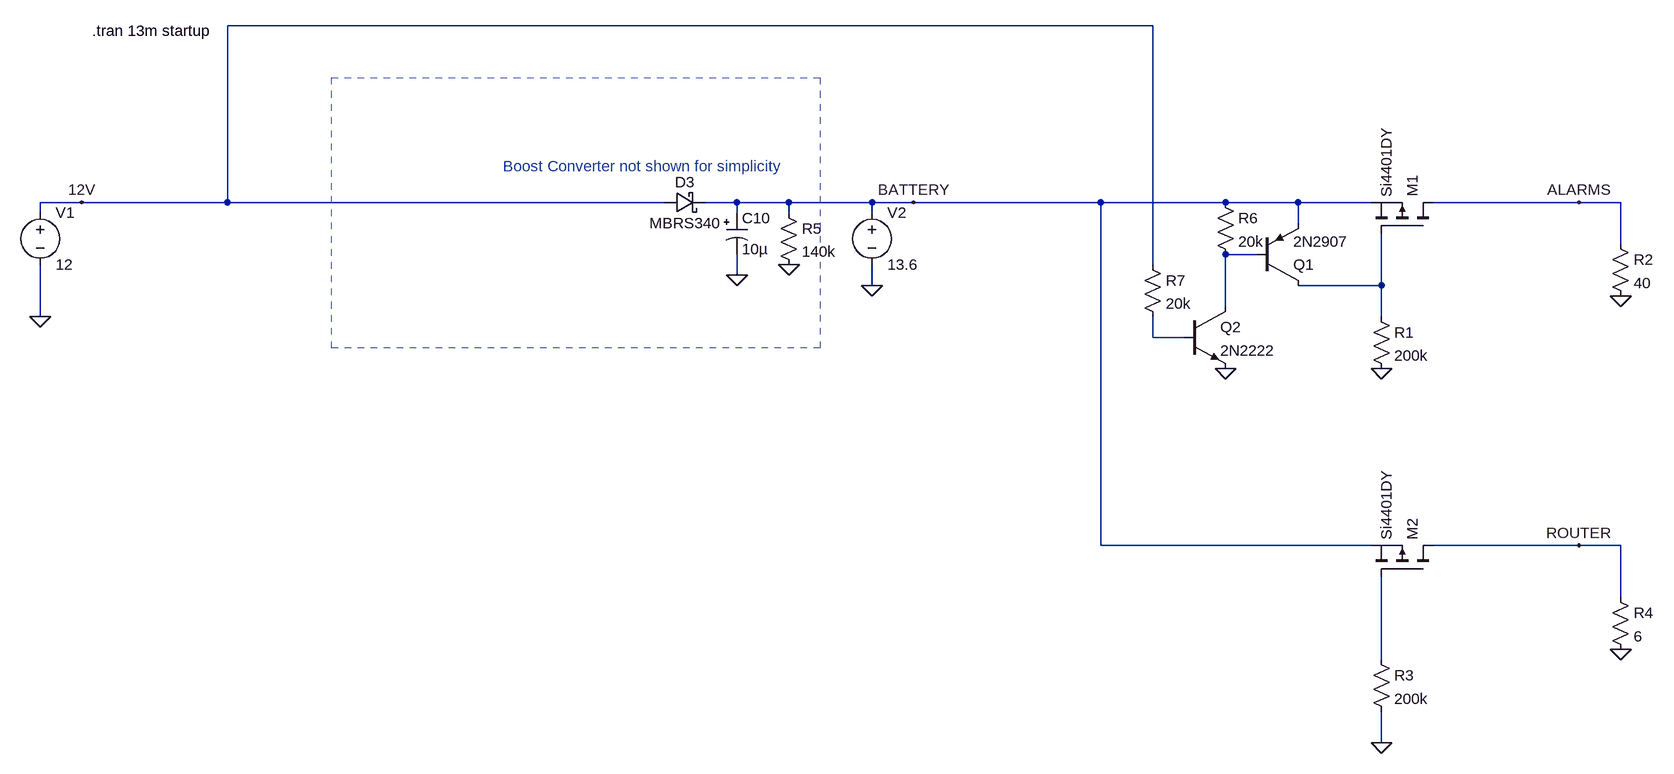
[diagram p0: schematic Security_Panel.asc]
Security_Panel.asc, the LTspice schematic file:
Version 4
SHEET 1 3064 1428
WIRE 2272 304 848 304
WIRE 624 576 560 576
WIRE 848 576 848 304
WIRE 848 576 624 576
WIRE 1520 576 848 576
WIRE 1632 576 1584 576
WIRE 1712 576 1632 576
WIRE 1840 576 1712 576
WIRE 1904 576 1840 576
WIRE 2192 576 1904 576
WIRE 2384 576 2192 576
WIRE 2496 576 2384 576
WIRE 2608 576 2496 576
WIRE 2928 576 2704 576
WIRE 2992 576 2928 576
WIRE 560 592 560 576
WIRE 1632 592 1632 576
WIRE 1712 592 1712 576
WIRE 1840 592 1840 576
WIRE 2496 608 2496 576
WIRE 2992 640 2992 576
WIRE 2432 656 2384 656
WIRE 2272 672 2272 304
WIRE 1632 688 1632 656
WIRE 1840 704 1840 672
WIRE 2624 704 2624 624
WIRE 2624 704 2496 704
WIRE 2384 736 2384 656
WIRE 560 752 560 672
WIRE 2624 752 2624 704
WIRE 2272 784 2272 752
WIRE 2320 784 2272 784
WIRE 2192 1104 2192 576
WIRE 2608 1104 2192 1104
WIRE 2928 1104 2704 1104
WIRE 2992 1104 2928 1104
WIRE 2992 1184 2992 1104
WIRE 2624 1280 2624 1152
WIRE 2624 1408 2624 1360
FLAG 1632 688 0
FLAG 1840 704 0
FLAG 560 752 0
FLAG 1904 576 BATTERY
FLAG 624 576 12V
FLAG 2992 720 0
FLAG 2992 1264 0
FLAG 2928 1104 ROUTER
FLAG 2928 576 ALARMS
FLAG 1712 672 0
FLAG 2624 832 0
FLAG 2384 832 0
FLAG 2624 1408 0
SYMBOL voltage 560 576 R0
SYMATTR InstName V1
SYMATTR Value 12
SYMBOL voltage 1840 576 R0
WINDOW 123 0 0 Left 0
WINDOW 39 0 0 Left 0
SYMATTR InstName V2
SYMATTR Value 13.6
SYMBOL schottky 1520 560 M90
WINDOW 0 0 32 VBottom 2
WINDOW 3 32 32 VTop 2
SYMATTR InstName D3
SYMATTR Value MBRS340
SYMBOL polcap 1616 592 R0
SYMATTR InstName C10
SYMATTR Value 10µ
SYMATTR SpiceLine Rser=.1
SYMBOL pmos 2704 624 M270
SYMATTR InstName M1
SYMATTR Value Si4401DY
SYMBOL res 2608 736 R0
SYMATTR InstName R1
SYMATTR Value 200k
SYMBOL res 2976 624 R0
SYMATTR InstName R2
SYMATTR Value 40
SYMBOL pmos 2704 1152 M270
SYMATTR InstName M2
SYMATTR Value Si4401DY
SYMBOL res 2608 1264 R0
SYMATTR InstName R3
SYMATTR Value 200k
SYMBOL res 2976 1168 R0
SYMATTR InstName R4
SYMATTR Value 6
SYMBOL res 1696 576 R0
SYMATTR InstName R5
SYMATTR Value 140k
SYMBOL pnp 2432 704 M180
SYMATTR InstName Q1
SYMATTR Value 2N2907
SYMBOL npn 2320 736 R0
SYMATTR InstName Q2
SYMATTR Value 2N2222
SYMBOL res 2368 560 R0
SYMATTR InstName R6
SYMATTR Value 20k
SYMBOL res 2256 656 R0
SYMATTR InstName R7
SYMATTR Value 20k
TEXT 640 312 Left 2 !.tran 13m startup
TEXT 1272 520 Left 2 ;Boost Converter not shown for simplicity
RECTANGLE Normal 1760 800 1008 384 2

The netlist it stands for:
* Security_Panel.asc
V1 12V 0 12
V2 BATTERY 0 13.6
D3 12V BATTERY MBRS340
C10 BATTERY 0 10µ Rser=.1
M1 ALARMS N002 BATTERY BATTERY Si4401DY
R1 N002 0 200k
R2 ALARMS 0 40
M2 ROUTER N004 BATTERY BATTERY Si4401DY
R3 N004 0 200k
R4 ROUTER 0 6
R5 BATTERY 0 140k
Q1 N002 N001 BATTERY 0 2N2907
Q2 N001 N003 0 0 2N2222
R6 BATTERY N001 20k
R7 12V N003 20k
.model D D
.lib standard.dio
.model NPN NPN
.model PNP PNP
.lib standard.bjt
.model NMOS NMOS
.model PMOS PMOS
.lib standard.mos
.tran 13m startup
* Boost Converter not shown for simplicity
.backanno
.end